# Altium project nPOC-BB_beta_main-board.PrjPcb (part 1 of 4)
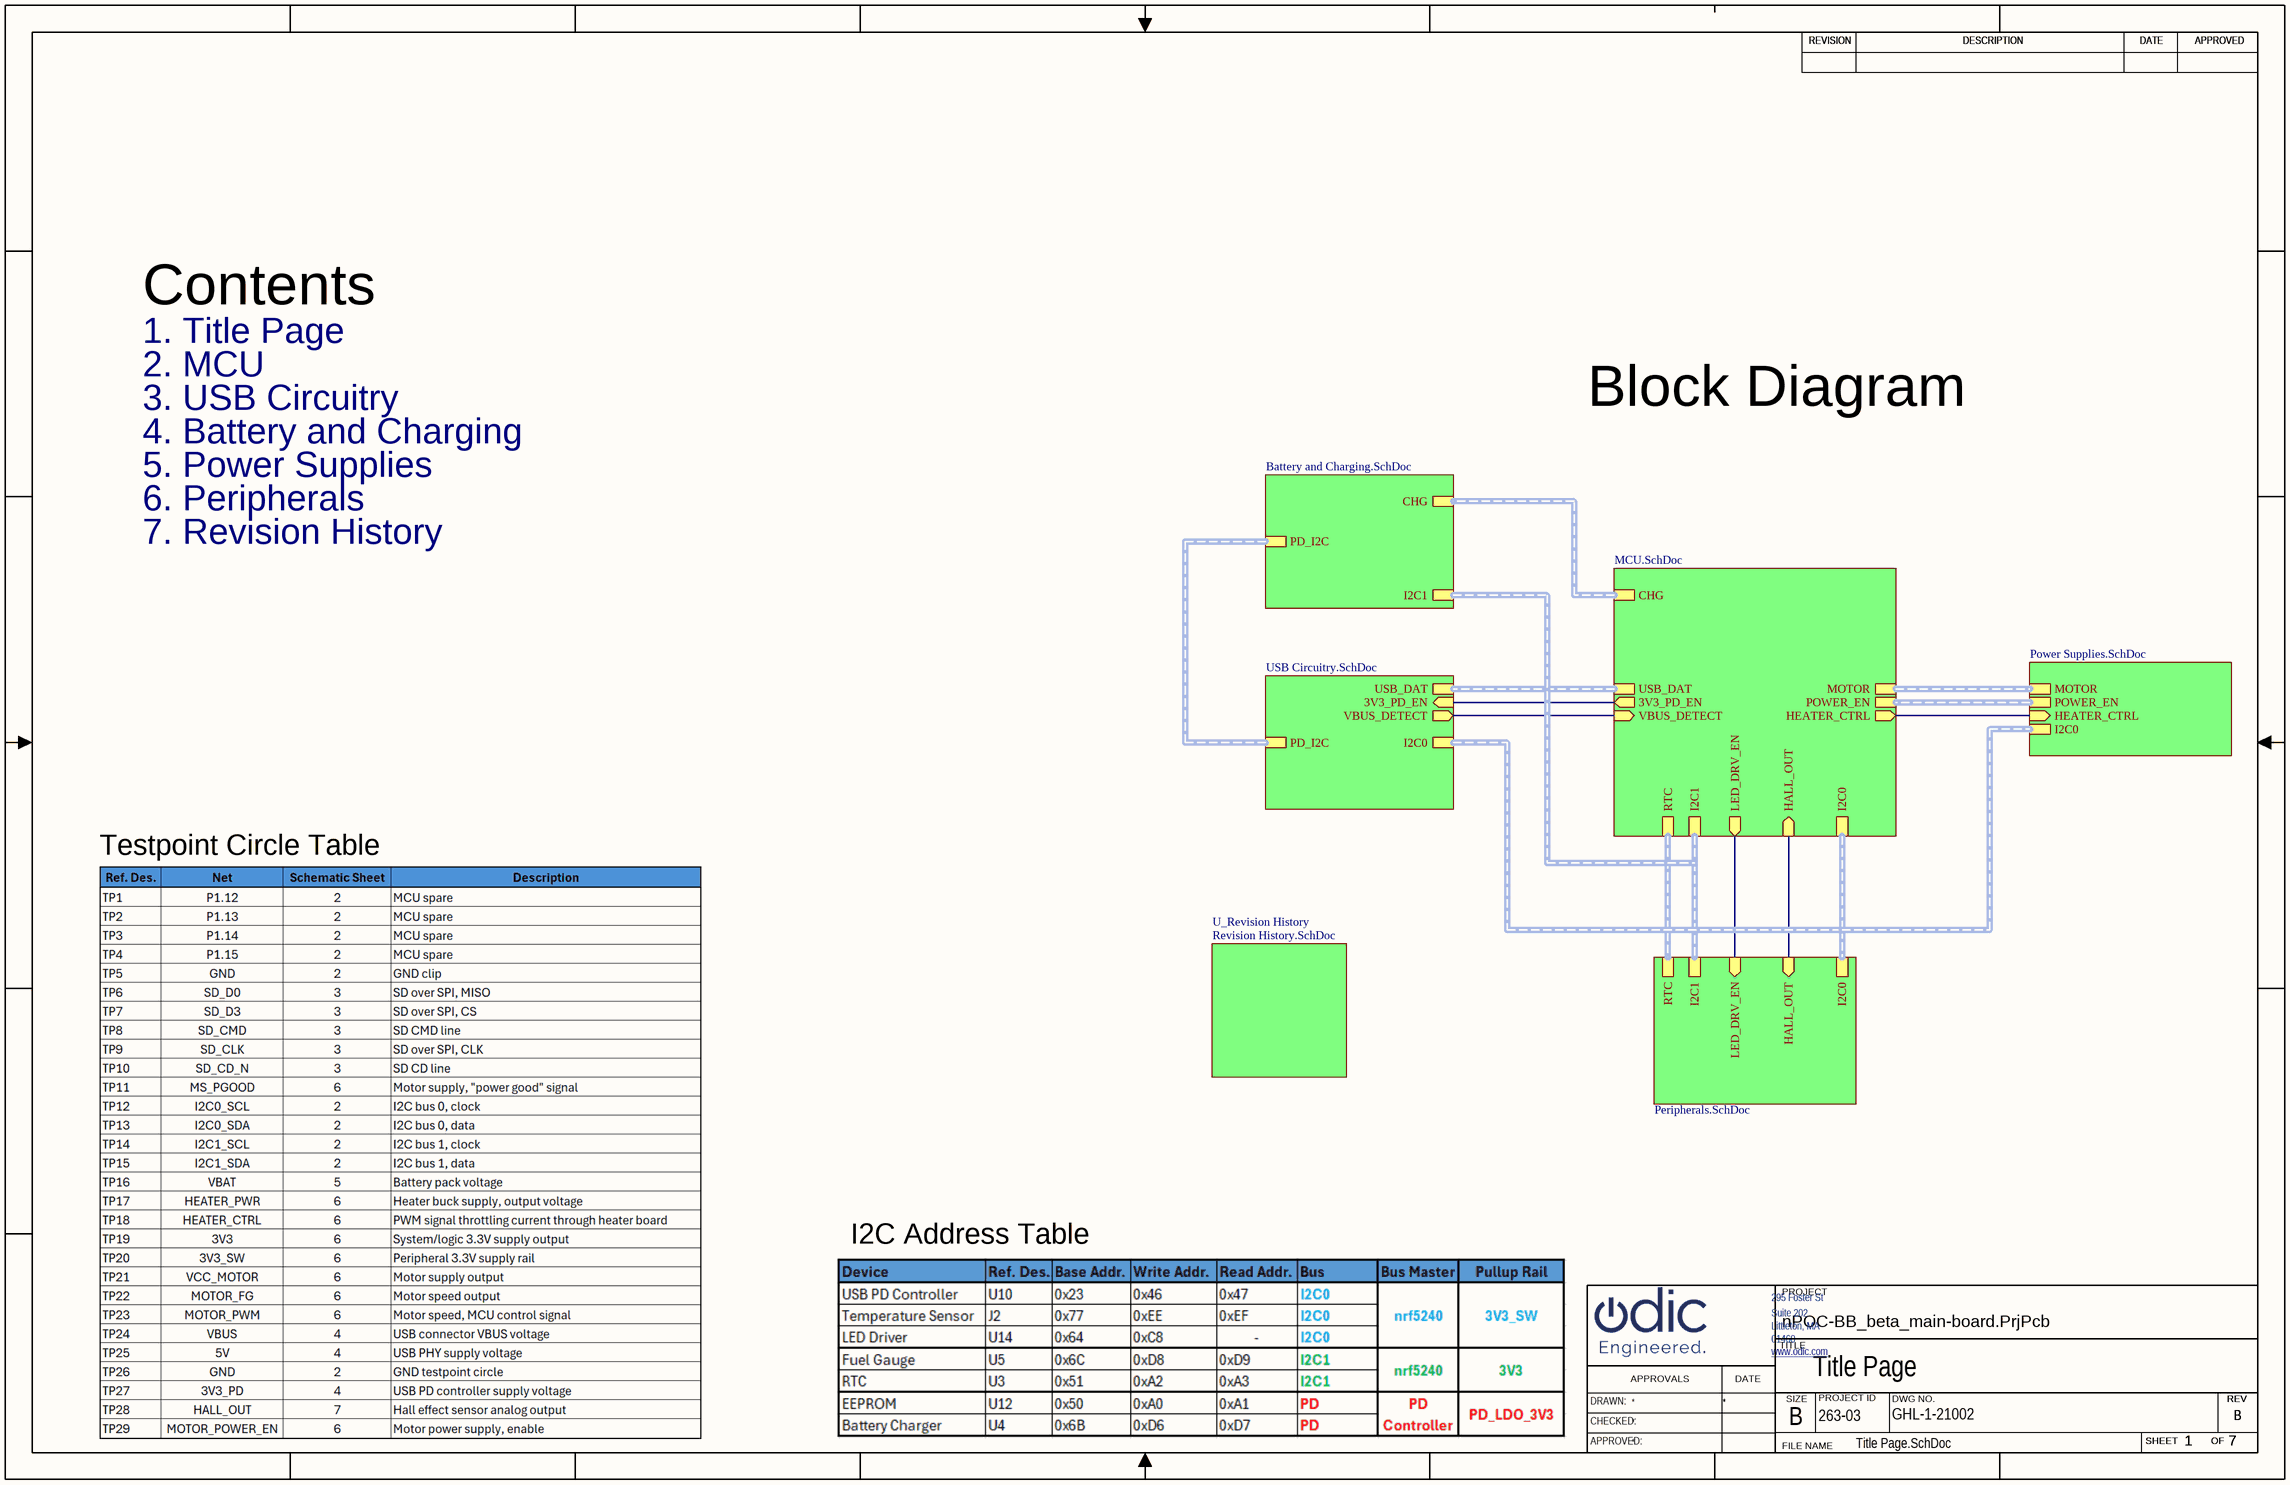
[diagram p0: Title Page.SchDoc]
7 sheets, 240 parts. Net scope: hierarchical (ports join the sheet entries above them; power ports are global).
Board file: nPOC-BB_beta_main-board.PcbDoc
Sheets:
  Title Page.SchDoc
    U_MCU = MCU.SchDoc
    U_USB Circuitry = USB Circuitry.SchDoc
    U_Battery and Charging = Battery and Charging.SchDoc
    U_Power Supplies = Power Supplies.SchDoc
    U_Peripherals = Peripherals.SchDoc
    U_Revision History = Revision History.SchDoc

## Sheet Title Page.SchDoc: Title Page
size 431 x 279 mm; DocumentNumber: GHL-1-21002; Revision: B; SheetNumber: 1; SheetTotal: 7; ProjectID: 263-03

### Sub-sheets
U_Battery and Charging = Battery and Charging.SchDoc: CHG (harness CHARGER), PD_I2C (harness I2C), I2C1 (harness I2C)
U_MCU = MCU.SchDoc: I2C0 (harness I2C), CHG (harness CHARGER), VBUS_DETECT (in), POWER_EN (harness Power Enables), LED_DRV_EN (out), 3V3_PD_EN (out), USB_DAT (harness USB_DAT), HALL_OUT (in), HEATER_CTRL (out), RTC (harness RTC), I2C1 (harness I2C), MOTOR (harness Motor)
U_Peripherals = Peripherals.SchDoc: I2C0 (harness I2C), LED_DRV_EN (in), I2C1 (harness I2C), RTC (harness RTC), HALL_OUT (in)
U_Power Supplies = Power Supplies.SchDoc: POWER_EN (harness Power Enables), I2C0 (harness I2C), HEATER_CTRL (in), MOTOR (harness Motor)
U_Revision History = Revision History.SchDoc: no entries
U_USB Circuitry = USB Circuitry.SchDoc: USB_DAT (harness USB_DAT), VBUS_DETECT (out), I2C0 (harness I2C), PD_I2C (harness I2C), 3V3_PD_EN (in)

### Nets
3V3_PD_EN: sheet U_MCU/3V3_PD_EN, sheet U_USB Circuitry/3V3_PD_EN
HALL_OUT: sheet U_MCU/HALL_OUT, sheet U_Peripherals/HALL_OUT
HEATER_CTRL: sheet U_MCU/HEATER_CTRL, sheet U_Power Supplies/HEATER_CTRL
LED_DRV_EN: sheet U_MCU/LED_DRV_EN, sheet U_Peripherals/LED_DRV_EN
VBUS_DETECT: sheet U_MCU/VBUS_DETECT, sheet U_USB Circuitry/VBUS_DETECT

### Buses and harness runs
harness sheet U_Battery and Charging/CHG = sheet U_MCU/CHG
harness sheet U_Battery and Charging/I2C1 = sheet U_MCU/I2C1 = sheet U_Peripherals/I2C1
harness sheet U_Battery and Charging/PD_I2C = sheet U_USB Circuitry/PD_I2C
harness sheet U_MCU/I2C0 = sheet U_Peripherals/I2C0 = sheet U_Power Supplies/I2C0 = sheet U_USB Circuitry/I2C0
harness sheet U_MCU/MOTOR = sheet U_Power Supplies/MOTOR
harness sheet U_MCU/POWER_EN = sheet U_Power Supplies/POWER_EN
harness sheet U_MCU/RTC = sheet U_Peripherals/RTC
harness sheet U_MCU/USB_DAT = sheet U_USB Circuitry/USB_DAT

### Notes on the sheet
- Contents
- 1. Title Page
- 2. MCU
- 3. USB Circuitry
- Block Diagram
- 4. Battery and Charging
- 5. Power Supplies
- 6. Peripherals
- 7. Revision History
- Testpoint Circle Table
- I2C Address Table
- REVISION
- DESCRIPTION
- DATE
- APPROVED
- 295 Foster St
- PROJECT
- www.odic.com <http://www.odic.com>
- Littleton, MA
- 01460
- Suite 202
- TITLE
- DRAWN:
- CHECKED:
- APPROVALS
- SIZE
- B
- PROJECT ID
- DWG NO.
- SHEET
- OF
- REV
- APPROVED:
- FILE NAME

## Sheet MCU.SchDoc: MCU
size 431 x 279 mm; DrawnBy: DD; DocumentNumber: GHL-1-21002; Revision: B; SheetNumber: 2; SheetTotal: 7; ProjectID: 263-03
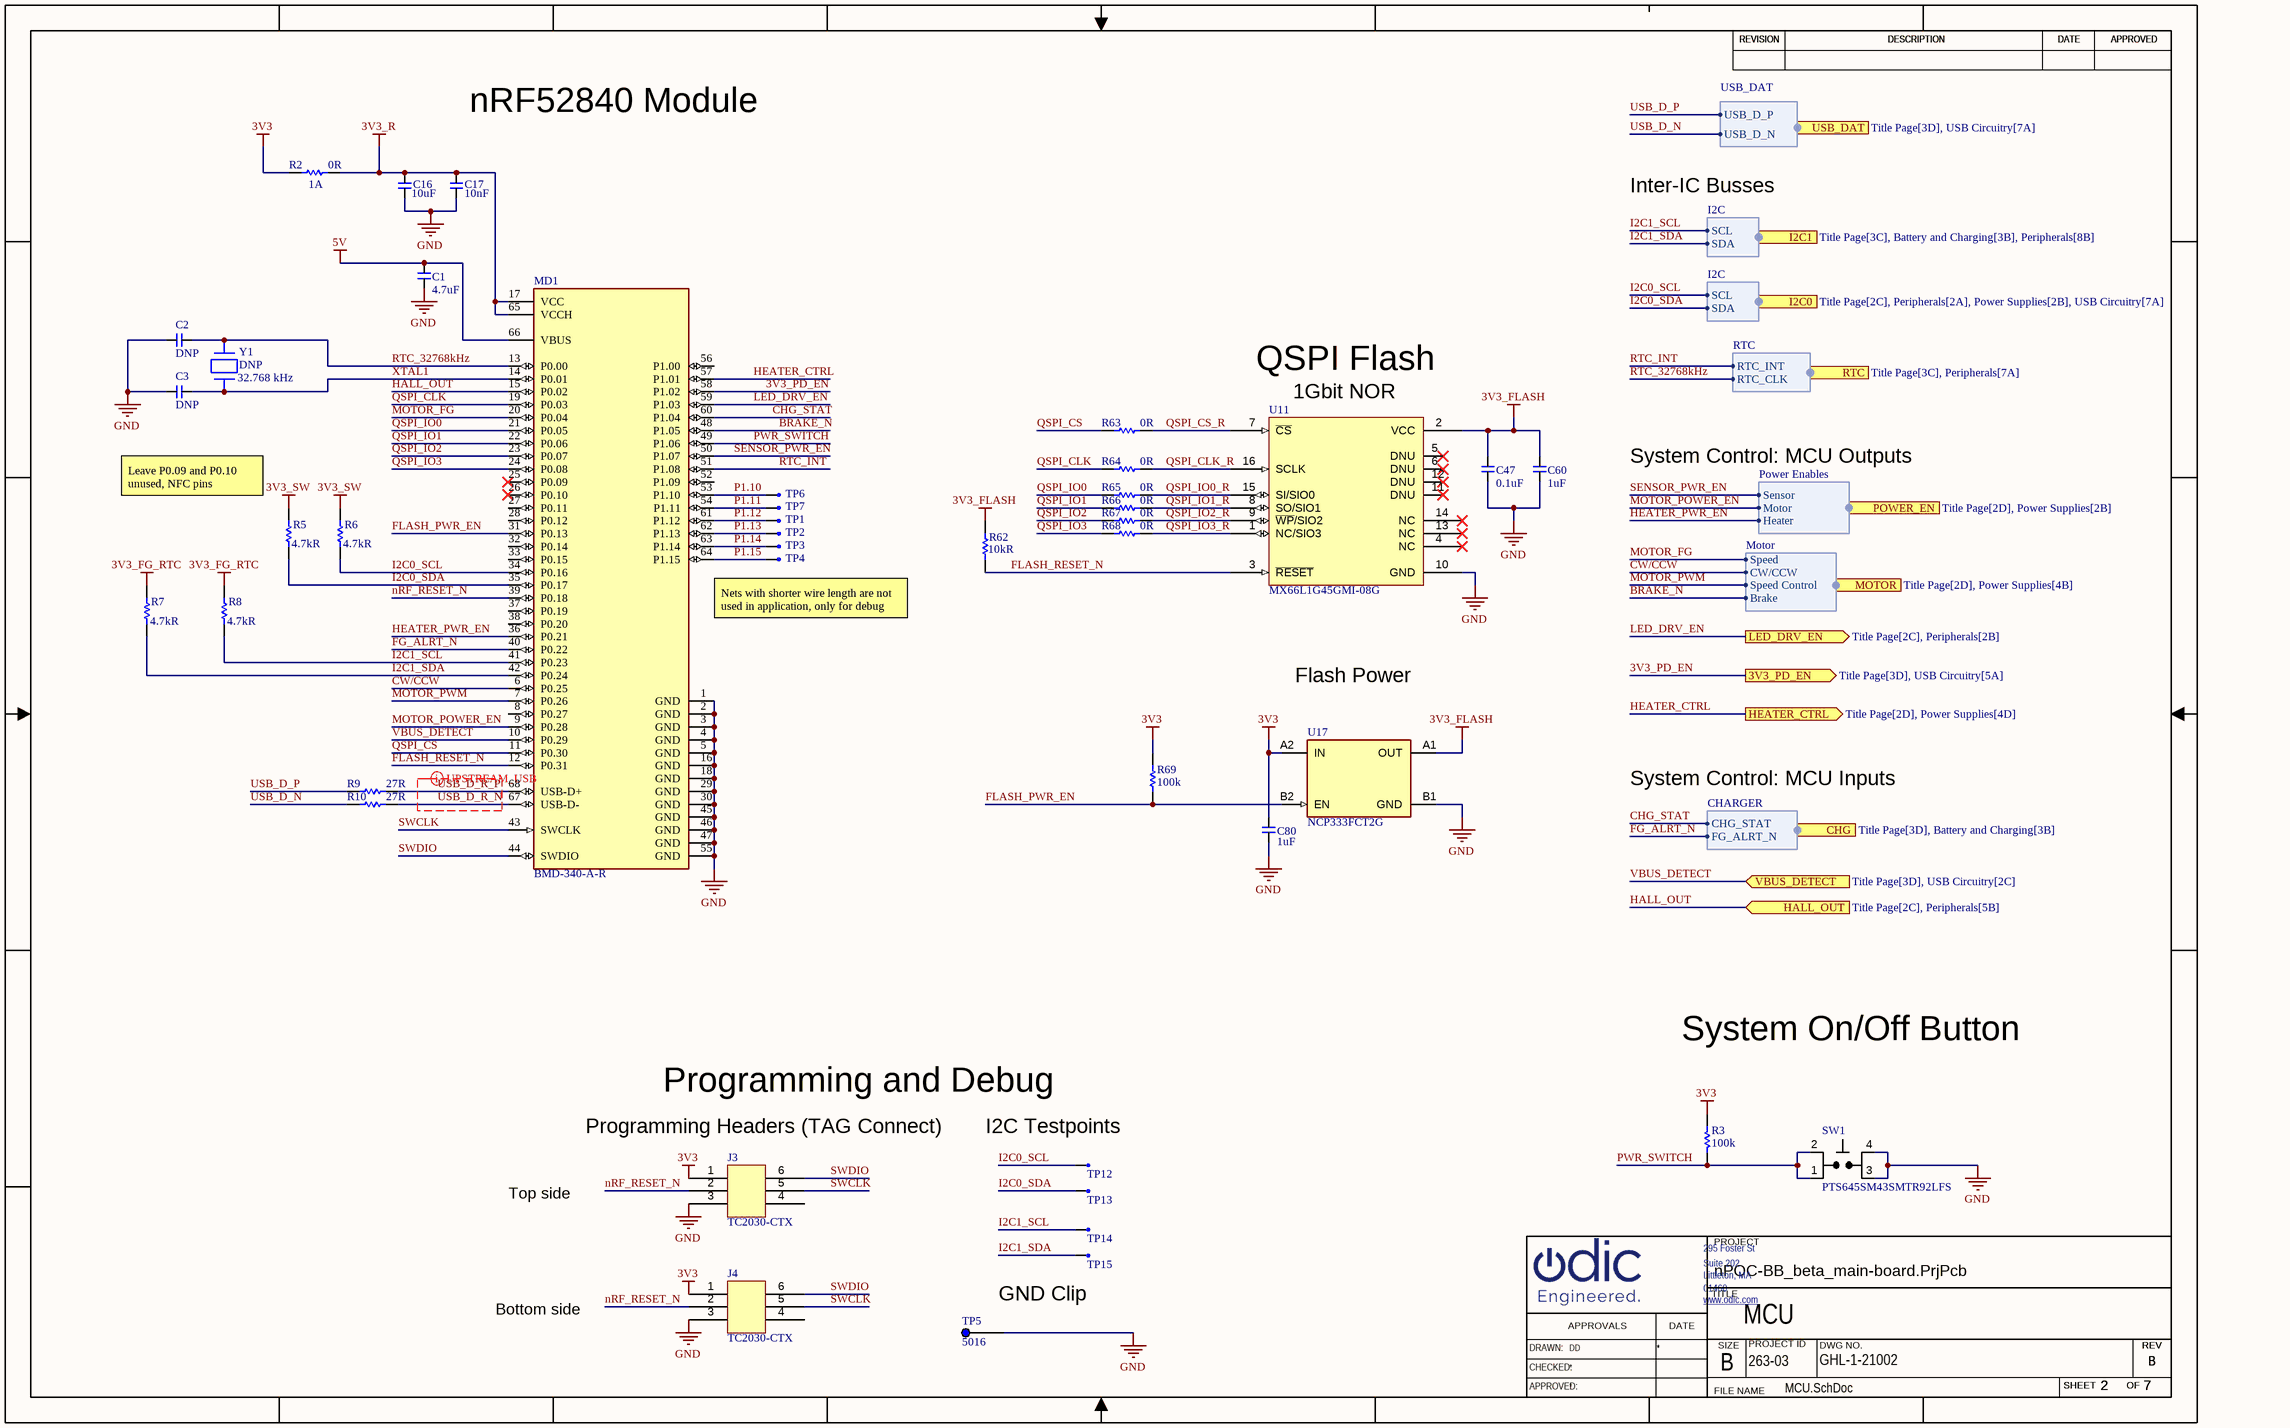
[diagram p1: MCU.SchDoc]

### Parts
C1  4.7uF  [C0603]
C2  DNP  [C0402]
C3  DNP  [C0402]
C16  Capacitance: 10uF  [C0402]  (hidden comment: C0402_10u_6V3_20pct)
C17  Capacitance: 10nF  [C0402]  (hidden comment: C0402_10n_6V3_10pct)
C47  0.1uF  [C0402]
C60  1uF  [C0402]
C80  Capacitance: 1uF  [C0402]  (hidden comment: C0402_1u_6V3_10pct)
J3  TC2030-CTX  [tc2030-ctx]
J4  TC2030-CTX  [tc2030-ctx]
MD1  BMD-340-A-R  [BMD-340-A-R]
R2  Resistance: 0R  Current Rating: 1A  [R0603]  (hidden comment: R0603_0R)
R3  100k  [R0402]
R5  Resistance: 4.7kR  [R0402]  (hidden comment: R0402_4k7_1pct)
R6  Resistance: 4.7kR  [R0402]  (hidden comment: R0402_4k7_1pct)
R7  Resistance: 4.7kR  [R0402]  (hidden comment: R0402_4k7_1pct)
R8  Resistance: 4.7kR  [R0402]  (hidden comment: R0402_4k7_1pct)
R9  27R  [R0402]
R10  27R  [R0402]
R62  Resistance: 10kR  [R0402]  (hidden comment: R0402_10k_1pct)
R63  0R  [R0402]
R64  0R  [R0402]
R65  0R  [R0402]
R66  0R  [R0402]
R67  0R  [R0402]
R68  0R  [R0402]
R69  100k  [R0402]
SW1  PTS645SM43SMTR92LFS  [swt_pb_pts645s]
TP1  TPC30  [tpc30]  (value not drawn)
TP2  TPC30  [tpc30]  (value not drawn)
TP3  TPC30  [tpc30]  (value not drawn)
TP4  TPC30  [tpc30]  (value not drawn)
TP5  5016  [KEYSTONE_5016]
TP6  TPC30  [tpc30]  (value not drawn)
TP7  TPC30  [tpc30]  (value not drawn)
TP12  TPC30  [tpc30]  (value not drawn)
TP13  TPC30  [tpc30]  (value not drawn)
TP14  TPC30  [tpc30]  (value not drawn)
TP15  TPC30  [tpc30]  (value not drawn)
U11  MX66L1G45GMI-08G  [sol16]
U17  NCP333FCT2G  [bga4_p743xp743_p4mm]
Y1  DNP  Operating Frequency: 32.768 kHz  [xtal2_3p2x1p5]

### Ports
3V3_PD_EN (out, see Title Page[3D], USB Circuitry[5A]), CHG (harness CHARGER, see Title Page[3D], Battery and Charging[3B]), HALL_OUT (in, see Title Page[2C], Peripherals[5B]), HEATER_CTRL (out, see Title Page[2D], Power Supplies[4D]), I2C0 (harness I2C, see Title Page[2C], Peripherals[2A], Power Supplies[2B], USB Circuitry[7A]), I2C1 (harness I2C, see Title Page[3C], Battery and Charging[3B], Peripherals[8B]), LED_DRV_EN (out, see Title Page[2C], Peripherals[2B]), MOTOR (harness Motor, see Title Page[2D], Power Supplies[4B]), POWER_EN (harness Power Enables, see Title Page[2D], Power Supplies[2B]), RTC (harness RTC, see Title Page[3C], Peripherals[7A]), USB_DAT (harness USB_DAT, see Title Page[3D], USB Circuitry[7A]), VBUS_DETECT (in, see Title Page[3D], USB Circuitry[2C])

### Harnesses
I2C: SCL, SDA
CHARGER: CHG_STAT, FG_ALRT_N
USB_DAT: USB_D_P, USB_D_N
Power Enables: Sensor, Motor, Heater
RTC: RTC_INT, RTC_CLK
Motor: Speed, CW/CCW, Speed Control, Brake

### Nets
3V3: C80.2 J3.1 J4.1 R2.1 R3.2 R69.1 U17.A2(IN)
3V3_FG_RTC: R7.2 R8.2
3V3_FLASH: C47.2 C60.2 R62.1 U11.2(VCC) U17.A1(OUT)
3V3_R: C16.2 C17.2 MD1.17(VCC) MD1.65(VCCH) R2.2
3V3_SW: R5.2 R6.2
5V: C1.2 MD1.66(VBUS)
GND: C1.1 C2.1 C3.1 C16.1 C17.1 C47.1 C60.1 C80.1 J3.3 J4.3 MD1.1(GND) MD1.2(GND) MD1.3(GND) MD1.4(GND) MD1.5(GND) MD1.16(GND) MD1.18(GND) MD1.29(GND) MD1.30(GND) MD1.45(GND) MD1.46(GND) MD1.47(GND) MD1.55(GND) SW1.3 SW1.4 TP5.1 U11.10(GND) U17.B1(GND)
3V3_PD_EN: MD1.58(P1.02) ; port 3V3_PD_EN
BRAKE_N: MD1.48(P1.05) ; port MOTOR.Brake
CHG_STAT: MD1.60(P1.04) ; port CHG.CHG_STAT
CW/CCW: MD1.6(P0.25) ; port MOTOR.CW/CCW
FG_ALRT_N: MD1.40(P0.22) ; port CHG.FG_ALRT_N
FLASH_PWR_EN: MD1.31(P0.13) R69.2 U17.B2(EN)
FLASH_RESET_N: MD1.12(P0.31) R62.2 U11.3(~{RESET})
HALL_OUT: MD1.15(P0.02) ; port HALL_OUT
HEATER_CTRL: MD1.57(P1.01) ; port HEATER_CTRL
HEATER_PWR_EN: MD1.36(P0.21) ; port POWER_EN.Heater
I2C0_SCL: MD1.34(P0.16) R6.1 TP12.1 ; port I2C0.SCL
I2C0_SDA: MD1.35(P0.17) R5.1 TP13.1 ; port I2C0.SDA
I2C1_SCL: MD1.41(P0.23) R8.1 TP14.1 ; port I2C1.SCL
I2C1_SDA: MD1.42(P0.24) R7.1 TP15.1 ; port I2C1.SDA
LED_DRV_EN: MD1.59(P1.03) ; port LED_DRV_EN
MOTOR_FG: MD1.20(P0.04) ; port MOTOR.Speed
MOTOR_POWER_EN: MD1.9(P0.28) ; port POWER_EN.Motor
MOTOR_PWM: MD1.7(P0.26) ; port MOTOR.Speed Control
nRF_RESET_N: J3.2 J4.2 MD1.39(P0.18)
P1.10: MD1.53(P1.10) TP6.1
P1.11: MD1.54(P1.11) TP7.1
P1.12: MD1.61(P1.12) TP1.1
P1.13: MD1.62(P1.13) TP2.1
P1.14: MD1.63(P1.14) TP3.1
P1.15: MD1.64(P1.15) TP4.1
PWR_SWITCH: MD1.49(P1.06) R3.1 SW1.1 SW1.2
QSPI_CLK: MD1.19(P0.03) R64.1
QSPI_CLK_R: R64.2 U11.16(SCLK)
QSPI_CS: MD1.11(P0.30) R63.1
QSPI_CS_R: R63.2 U11.7(~{CS})
QSPI_IO0: MD1.21(P0.05) R65.1
QSPI_IO0_R: R65.2 U11.15(SI/SIO0)
QSPI_IO1: MD1.22(P0.06) R66.1
QSPI_IO1_R: R66.2 U11.8(SO/SIO1)
QSPI_IO2: MD1.23(P0.07) R67.1
QSPI_IO2_R: R67.2 U11.9(~{WP}/SIO2)
QSPI_IO3: MD1.24(P0.08) R68.1
QSPI_IO3_R: R68.2 U11.1(NC/SIO3)
RTC_32768kHz: C2.2 MD1.13(P0.00) Y1.1 ; port RTC.RTC_CLK
RTC_INT: MD1.51(P1.08) ; port RTC.RTC_INT
SENSOR_PWR_EN: MD1.50(P1.07) ; port POWER_EN.Sensor
SWCLK: J3.5 J4.5 MD1.43(SWCLK)
SWDIO: J3.6 J4.6 MD1.44(SWDIO)
USB_D_N: R10.1 ; port USB_DAT.USB_D_N
USB_D_P: R9.1 ; port USB_DAT.USB_D_P
USB_D_R_N: MD1.67(USB-D-) R10.2
USB_D_R_P: MD1.68(USB-D+) R9.2
VBUS_DETECT: MD1.10(P0.29) ; port VBUS_DETECT
XTAL1: C3.2 MD1.14(P0.01) Y1.2

Not connected (* = marked no-connect by the designer): J3 4; J4 4; MD1 8(P0.27) 25(P0.09)* 26(P0.10)* 27(P0.11) 28(P0.12) 32(P0.14) 33(P0.15) 37(P0.19) 38(P0.20) 52(P1.09) 56(P1.00); U11 4(NC)* 5(DNU)* 6(DNU)* 11(DNU)* 12(DNU)* 13(NC)* 14(NC)*

### Layout directives
differential pair: USB_D_R_N, USB_D_R_P

### Notes on the sheet
- nRF52840 Module
- Inter-IC Busses
- QSPI Flash
- (near U11) 1Gbit NOR
- System Control: MCU Outputs
- (near R5) Leave P0.09 and P0.10 unused, NFC pins
- Nets with shorter wire length are not used in application, only for debug
- Flash Power
- System Control: MCU Inputs
- System On/Off Button
- Programming and Debug
- (near J3) Programming Headers (TAG Connect)
- (near TP12) I2C Testpoints
- Top side
- Bottom side
- GND Clip
- REVISION
- DESCRIPTION
- DATE
- APPROVED
- 295 Foster St
- PROJECT
- www.odic.com <http://www.odic.com>
- Littleton, MA
- 01460
- Suite 202
- TITLE
- DRAWN:
- CHECKED:
- APPROVALS
- SIZE
- B
- PROJECT ID
- DWG NO.
- SHEET
- OF
- REV
- APPROVED:
- FILE NAME

### Library data of the parts
C1 = CMP-00579-3: CAP CER 4.7UF 25V X5R 0603; Dielectric Material: Ceramic; Tolerance: 20%; Install: POP; Case Code (Imperial): 0603; Case Code (Metric): 1608; Value: 4.7uF; Case/Package: 0603; Radiation Hardening: No; Voltage Rating (DC): 25V; Width: 0.031inch; Min Operating Temperature: -55°C; Depth: 0.8mm; Mounting Technology: Surface Mount; Max Operating Temperature: 85°C; RoHS Compliant: Yes; Weight: 7.1E-05oz; Length: 1.6mm; Height: 0.8mm; Package Quantity: 1; Dielectric: X5R; Termination: SMD/SMT; Voltage Rating: 25V; Reach SVHC Compliant: Unknown; Series: C; Thickness: 0.039inch; Packaging: Tape and Reel; Lead Free: Lead Free
C2 C3 = CMP-00017-6: Blank pads for future cap placements; Install: DNP; Odic Footprint: C0402
C16 = CMP-00337-1: Cap Ceramic 10uF 6.3V X5R 20% SMD 0402 85°C Paper T/R; Install: POP; Mount: Surface Mount; Construction: Flat; Case Code (Imperial): 0402; Case/Package: 0402; Series: CL; Package Quantity: 1; Width: 0.02inch; Dielectric: X5R; Radiation Hardening: No; Case Code (Metric): 1005; RoHS Compliant: Yes; Depth: 0.5mm; Height: 0.5mm; Packaging: Tape and Reel; Min Operating Temperature: -55°C; Tolerance: 20%; Voltage Rating: 6.3V; Max Operating Temperature: 85°C; Thickness: 0.028inch; Length: 1mm
C17 = CMP-00314-2: CAP CER 10000PF 25V 10% X7R 0402; Install: POP; Ratings: AEC-Q200; Lead Free: Lead Free; Series: GCM; Tolerance: 10%; Min Operating Temperature: -55°C; Thickness: 0.022inch; Case Code (Imperial): 0402; Width: 0.02inch; Construction: Flat; Length: 1mm; Radiation Hardening: No; Termination: SMD/SMT; Height: 0.5mm; REACH SVHC: No SVHC; Voltage Rating: 25V; Depth: 0.5mm; RoHS Compliant: Yes; Package Quantity: 1; Mount: Surface Mount; Case Code (Metric): 1005; Dielectric: X7R; Packaging: Tape and Reel; Voltage Rating (DC): 25V; Max Operating Temperature: 125°C; Voltage: 25V; Case/Package: 0402
C47 = CMP-00369-1: Cap Ceramic 0.1uF 25V X5R 10% Pad SMD 0402 Multi Layer Ceramic Capacitor (MLCC); Capacitance: 100nF; Install: POP; Packaging: Tape and Reel; Construction: Flat; Max Operating Temperature: 85°C; Case Code (Metric): 1005; Voltage Rating (DC): 25V; Min Operating Temperature: -55°C; Height: 0.5mm; Series: CL; Case/Package: 0402; Voltage: 25V; Package Quantity: 1; Radiation Hardening: No; Depth: 0.5mm; Thickness: 0.022inch; Lead Free: Lead Free; Tolerance: 10%; Length: 1mm; Mount: Surface Mount; Width: 0.02inch; Dielectric: X5R; RoHS Compliant: Yes; Voltage Rating: 25V; Case Code (Imperial): 0402
C60 = CMP-00317-1: CAP CER 1UF 16V X5R 0402; Install: POP; Tolerance: 10%; Thickness: 0.022inch; Radiation Hardening: No; Voltage Rating: 16V; Length: 1mm; Voltage: 16V; Capacitance: 1uF; Dielectric: X5R; Packaging: Tape and Reel; Contact Plating: Tin; Min Operating Temperature: -55°C; Series: CL; Depth: 0.5mm; Case Code (Imperial): 0402; Case Code (Metric): 1005; Package Quantity: 1; RoHS Compliant: Yes; Height: 0.5mm; Mount: Surface Mount; Max Operating Temperature: 85°C; Case/Package: 0402; Width: 0.02inch; Construction: Flat
C80 = CMP-00342-1: Cap Ceramic 1uF 6.3V X5R 10% SMD 0402 85C Paper T/R; Install: POP; Max Operating Temperature: 85°C; RoHS Compliant: Yes; Number of Pins: 2; Packaging: Tape and Reel; Thickness: 0.022inch; Lead Free: Lead Free; Package Quantity: 10000; Tolerance: 10%; Height: 0.5mm; Depth: 0.5mm; Construction: Flat; Radiation Hardening: No; REACH SVHC: No SVHC; Dielectric: X5R; Resistor Type: Ceramic; Min Operating Temperature: -55°C; Series: M; Width: 0.5mm; Case/Package: 0402; Voltage Rating: 6.3V; Case Code (Imperial): 0402; Length: 1mm; Voltage Rating (DC): 6.3V; Halogen Free: Halogen Free; Termination: SMD/SMT; Mount: Surface Mount; Case Code (Metric): 1005
J3 J4 = CMP-00997-3: Cbl Plug-of-nails to Cortex Swd; Install: DNP; Series: Plug-Of-Nails™
MD1 = CMP-002-000005-3: BMD-340 Series 3.6 V 2.5 GHz -96 dBm Stand-Alone Bluetooth 5 Low Energy Module; Data Rate: 2Mbps; Memory Size: 256KB; MP: BMD-330-A-R; Sensitivity: -103dBm; Current - Transmitting: 26.7mA; Interface: I2C,SPI,UART; Frequency: 2.5GHz; Current - Receiving: 11.7mA; Install: POP; Series: BMD-34; Package: None; Price: None; Source: BMD-330-A-R.SchLib; RoHS Compliant: Yes; Min Operating Temperature: -40°C; Max Operating Temperature: 85°C; Design Item ID: BMD-330-A-R; Case/Package: Module; Packaging: Tape and Reel; Mounting Technology: Surface Mount
R2 = CMP-00334-1: Res Thkflm 0603 0 Ohm Jumper 1/10W 100Ppm/ C Smd Rohs Compliant: Yes; Working Voltage: 75V; Max Power Dissipation: 100mW; Install: POP; Case/Package: 0603; Case Code (Metric): 1608; RoHS Compliant: Yes; Contact Plating: Tin,Matte; Length: 1.55mm; Series: RMCF; Radiation Hardening: No; Features: Automotive AEC-Q200; Military Standard: Not; Max Operating Temperature: 155°C; Number of Terminations: 2; Packaging: Tape and Reel; Case Code (Imperial): 0603; Mount: Surface Mount; Min Operating Temperature: -55°C; Power Rating: 100mW; Width: 0.031inch; Depth: 0.8mm; Resistor Type: Thick Film; Height: 0.022inch; Construction: Rectangular; Lead Free: Lead Free
R3 R69 = CMP-00351-1: Res General Purpose Thick Film 0402 100K Ohm 1% 1/16W ±100ppm/°C Molded SMD Paper T/R; Working Voltage: 50V; Resistance: 100kR; Install: POP; Power Rating: 63mW; Series: RC; Military Standard: Not; Case Code (Metric): 1005; Features: Moisture Resistant; Termination: SMD/SMT; Number of Terminations: 2; Temperature Coefficient: 100ppm/°C; Height: 0.016inch; Tolerance: 1%; Case/Package: 0402; Depth: 0.5mm; RoHS Compliant: Yes; Resistance Tolerance: 1%; Lead Free: Lead Free; Max Operating Temperature: 155°C; Min Operating Temperature: -55°C; Width: 0.02inch; Packaging: Tape and Reel; Technology: THICK FILM; Case Code (Imperial): 0402; Package Quantity: 1; REACH SVHC: No SVHC; Resistor Type: Thick Film; Max Power Dissipation: 63mW; Voltage Rating: 50V; Length: 0.039inch; Construction: Rectangular
R5-R8 = CMP-00336-2: RES 4.7K OHM 1% 1/16W 0402; Install: POP; Temperature Coefficient: 100ppm/°C; Voltage Rating: 50V; Max Power Dissipation: 63mW; Power Rating: 62.5mW; Features: Moisture Resistant; Length: 1mm; REACH SVHC: No SVHC; RoHS Compliant: Yes; Military Standard: Not; Size Code: 0402; Series: RC; Width: 0.5mm; Lead Free: Lead Free; Max Operating Temperature: 155°C; Height: 0.32mm; Voltage Rating (DC): 50V; Construction: Rectangular; Packaging: Tape and Reel; Tolerance: 1%; Case Code (Metric): 1005; Case Code (Imperial): 0402; Number of Pins: 2; Resistor Type: Thick Film; Number of Terminations: 2; Termination: SMD/SMT; Min Operating Temperature: -55°C; Case/Package: 0402; Height - Seated (Max): 0.016inch; Resistance Tolerance: 1%; Depth: 0.5mm
R9 R10 = CMP-009-00036-1: SMD Chip Resistor, 27 Ohm, ± 1%, 100 mW, 0402 [1005 Metric], Thick Film, Precision; Install: POP; Temperature Coefficient: 100ppm/°C; Power Rating: 100mW; Voltage Rating (DC): 50V; Min Operating Temperature: -55°C; Number of Terminations: 2; Max Operating Temperature: 155°C; Tolerance: 1%; Mounting Technology: Surface Mount; Lead Free: Lead Free; Width: 0.5mm; Package Quantity: 1; Resistor Type: Thick Film; Weight: 2.8E-05oz; Length: 1mm; Technology: THICK FILM; Case Code (Metric): 1005; Series: ERJ; Resistance Tolerance: 1%; Pins: 2; Reach SVHC Compliant: No; Case/Package: 0402; Packaging: Tape and Reel; Height: 0.35mm; Max Power Dissipation: 100mW; Case Code (Imperial): 0402; Value: 27R; Contact Plating: Tin; Features: Automotive AEC-Q200; Voltage Rating: 50V; Depth: 0.5mm; Termination: SMD/SMT; RoHS Compliant: Yes
R62 = CMP-00352-1: Res Thick Film 0402 10K Ohm 1% 1/16W ±100ppm/°C Molded SMD SMD T/R; Max Power Dissipation: 63mW; Install: POP; RoHS Compliant: Yes; Number of Terminations: 2; Case/Package: 0402; Case Code (Metric): 1005; Length: 0.039inch; Military Standard: Not; Size Code: 0402; Series: RC; Height: 0.016inch; Contact Plating: Tin; Features: Moisture Resistant; Width: 0.02inch; Mount: Surface Mount; Temperature Coefficient: 100ppm/°C; Package Quantity: 1; Resistor Type: Thick Film; Min Operating Temperature: -55°C; Max Operating Temperature: 155°C; Power Rating: 63mW; Tolerance: 1%; Depth: 0.5mm; Case Code (Imperial): 0402; Construction: Rectangular; Packaging: Tape and Reel; Radiation Hardening: No
R63-R68 = CMP-00319-1: RES 0 OHM JUMPER 1/16W 0402; Max Power Dissipation: 63mW; Install: POP; Working Voltage: 50V; Current Rating: 1A; Case/Package: 0402; Max Operating Temperature: 155°C; Contact Plating: Tin,Matte; Height: 0.016inch; RoHS Compliant: Yes; Lead Free: Lead Free; Length: 0.039inch; Case Code (Imperial): 0402; Resistor Type: Thick Film; Military Standard: Not; Width: 0.02inch; Construction: Rectangular; Features: Automotive AEC-Q200; Depth: 0.5mm; Case Code (Metric): 1005; Technology: THICK FILM; Number of Terminations: 2; Power Rating: 63mW; Radiation Hardening: No; Min Operating Temperature: -55°C; Series: RMCF; Packaging: Tape and Reel; Mount: Surface Mount; Resistance: 0R
SW1 = CMP-011-00000-2: Switch Tactile N.O. SPST Round Button Gull Wing 0.05A 12VDC 100000Cycles 1.57N SMD T/R; Actuator Type: Standard; Operating Force: 160gf; Number of Positions: 2; Illumination Type: Non-Illuminated,Illuminated; Actuator Material: Nylon,Polyamide,PA66; Max Current Rating: 50mA; Actuator Length: 0.85mm; Switch Function: Off-Mom; Install: POP; Max Voltage Rating (DC): 12V; Contact Resistance: 100mR; Contact Material: Silver; Size: 6mm; Min Operating Temperature: -20°C; RoHS Compliant: Yes; Depth: 9mm; Contact Plating: Silver; Lead Free: Lead Free; Case/Package: SMD/SMT; Length: 6mm; Termination: Gull Wing; Max Operating Temperature: 60°C; Throw Configuration: SPST; Orientation: Straight; Mounting Technology: Surface Mount; Current Rating: 50mA; Contact Current Rating: 50mA; Mechanical Life: 100000Cycles; Packaging: Tape and Reel; Package Quantity: 1; Voltage Rating (DC): 12V; Color: Black; Reach SVHC Compliant: No; Series: PTS645
TP1-TP4 TP6 TP7 TP12-TP15 = CMP-00021-4: Test Point Circle 30; Install: DNP
TP5 = CMP-00809-3: Test point clip, SMT Phos Bronze/Silver 1000pc Tape & Reel; Install: POP; Number of Ports: 1; Length: 3.81mm; Insulation Material: Polycarbonate; Series: -; Depth: 2.48mm; Material: Bronze,Silver; Contact Material: Bronze; Packaging: Tape and Reel; Color: White; Number of Contacts: 1; Orientation: Straight; Package Quantity: 1; RoHS Compliant: Yes; Reach SVHC Compliant: No; Termination: Solder; Height: 0.09inch; Mounting Technology: Surface Mount; Contact Plating: Silver; Lead Free: Lead Free
U11 = CMP-00954-3: MX66L1G45G Series 1 Gb (1 G x 1) 2.7 - 3.6 V SMT Serial Flash Memory - SOP-16; RoHS Compliant: Yes
U17 = CMP-00215-5: IC LOAD SWITCH W/DIS 1.5A 4WLCSP; Interface: On/Off; On-State Resistance: 400mR; Install: POP; Output Configuration: High Side; Max Power Dissipation: 400mW; Operating Supply Voltage: 5.5V; Turn-On Delay Time: 195us; Number of Outputs: 1; Max Operating Temperature: 85°C; Series: -; Max Output Current: 1.5A; Number of Pins: 4; Halogen Free: Halogen Free; RoHS Compliant: Yes; Output Current: 1.5A; Mount: Surface Mount; Min Operating Temperature: -40°C; Packaging: Tape and Reel; Lead Free: Lead Free; Package Quantity: 3000; Power Dissipation: 400mW; Max Supply Current: 1.5A
Y1 = CMP-00624-3: RT3215 Series 0.032768 ±20 ppm 9pF -40°C TO +85°C SMT Tuning Fork Crystal; Value: 9E-12F; Frequency Tolerance: 20ppm; RoHS Compliant: Yes; Min Operating Temperature: -40°C; Max Operating Temperature: 85°C; Lead Free: Lead Free; Load Capacitance: 9pF; Install: DNP

## Sheet USB Circuitry.SchDoc: USB Circuitry
size 431 x 279 mm; DrawnBy: DD; DocumentNumber: GHL-1-21002; Revision: B; SheetNumber: 3; SheetTotal: 7; ProjectID: 263-03
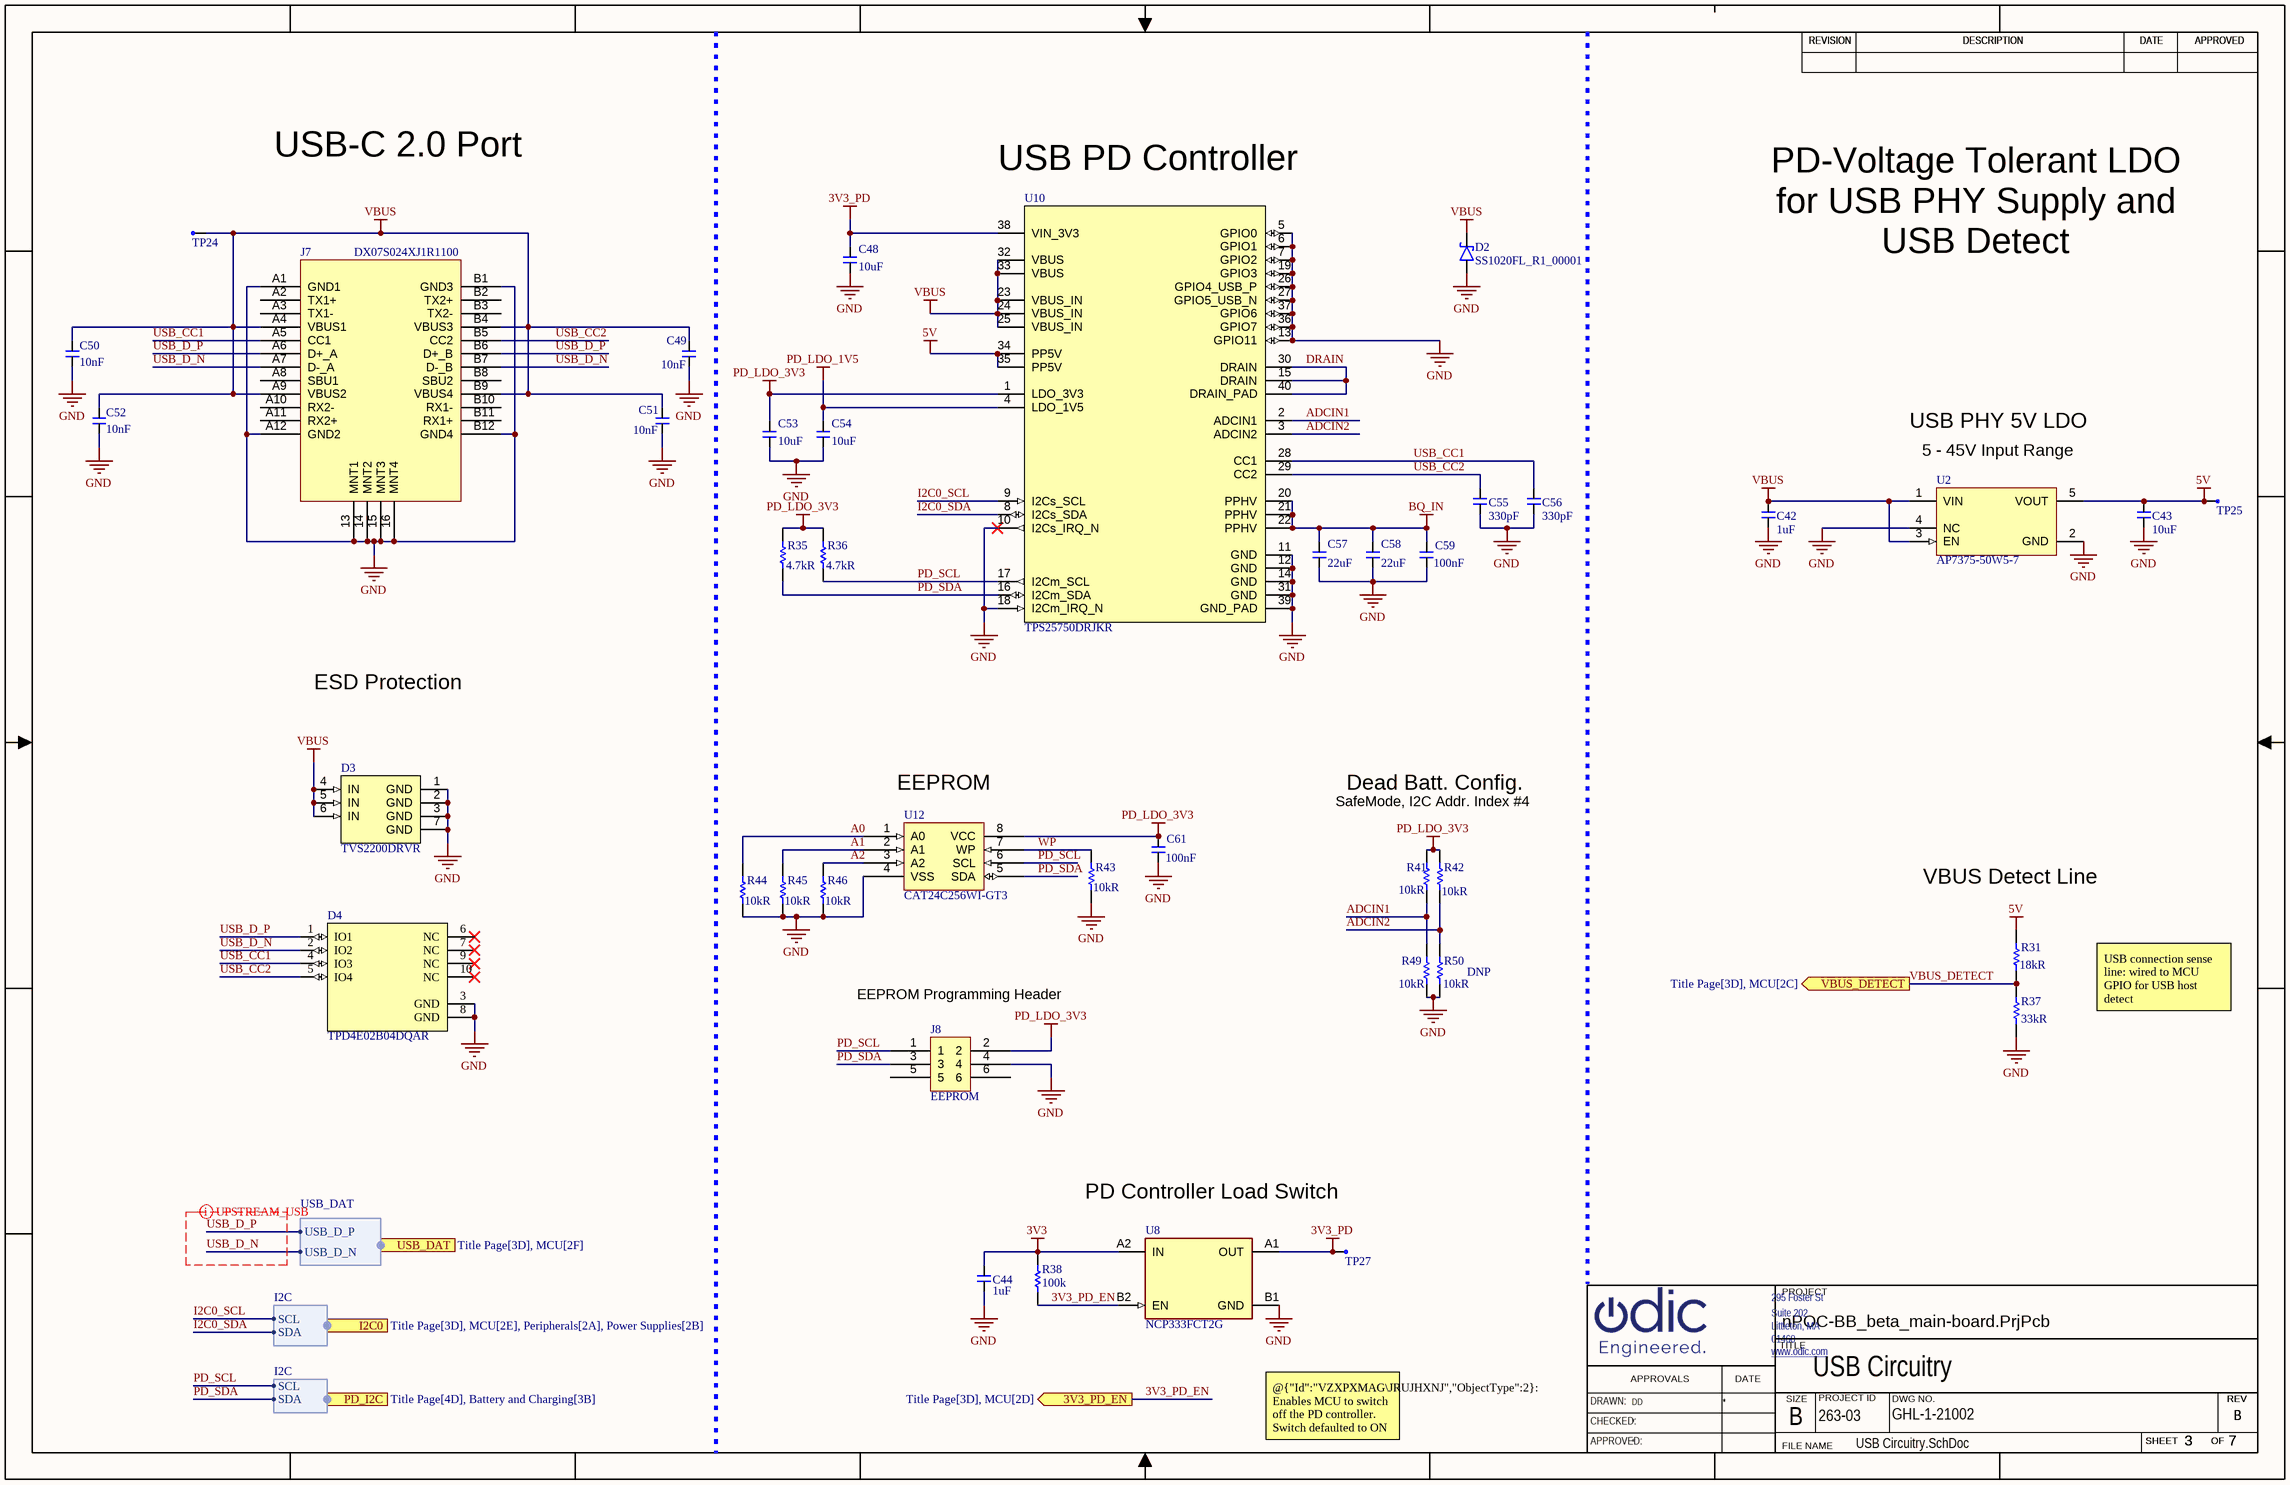
[diagram p2: USB Circuitry.SchDoc]

### Parts
C42  1uF  [C0603]
C43  10uF  [C0402]
C44  Capacitance: 1uF  [C0402]  (hidden comment: C0402_1u_6V3_10pct)
C48  Capacitance: 10uF  [C0402]  (hidden comment: C0402_10u_10V_20pct)
C49  value 10nF  [C0402]  (hidden comment: C0402_10n_35V_10pct)
C50  value 10nF  [C0402]  (hidden comment: C0402_10n_35V_10pct)
C51  value 10nF  [C0402]  (hidden comment: C0402_10n_35V_10pct)
C52  value 10nF  [C0402]  (hidden comment: C0402_10n_35V_10pct)
C53  Capacitance: 10uF  [C0402]  (hidden comment: C0402_10u_10V_20pct)
C54  Capacitance: 10uF  [C0402]  (hidden comment: C0402_10u_10V_20pct)
C55  value 330pF  [C0402]  (hidden comment: C0402_330p_50V_10pct)
C56  value 330pF  [C0402]  (hidden comment: C0402_330p_50V_10pct)
C57  Capacitance: 22uF  [c0805]  (hidden comment: C0805_22u_25V_20pct)
C58  Capacitance: 22uF  [c0805]  (hidden comment: C0805_22u_25V_20pct)
C59  Capacitance: 100nF  [C0402]  (hidden comment: C0402_0u1_25V_10pct)
C61  Capacitance: 100nF  [C0402]  (hidden comment: C0402_0u1_25V_10pct)
D2  SS1020FL_R1_00001  [sod-123fl_AK]
D3  TVS2200DRVR  [dfn7_2x2_p65mm]
D4  TPD4E02B04DQAR  [dfn10_1p1x2p6_p5mm]
J7  DX07S024XJ1R1100  [USB_JAE_DX07S024XJ1R1100]
J8  EEPROM  [tc2030-mcp-nl]
R31  value 18kR  [R0402]  (hidden comment: R0402_18k_1pct)
R35  Resistance: 4.7kR  [R0402]  (hidden comment: R0402_4k7_1pct)
R36  Resistance: 4.7kR  [R0402]  (hidden comment: R0402_4k7_1pct)
R37  Resistance: 33kR  [R0402]  (hidden comment: R0402_33k_1pct)
R38  100k  [R0402]
R41  Resistance: 10kR  [R0402]  (hidden comment: R0402_10k_1pct)
R42  Resistance: 10kR  [R0402]  (hidden comment: R0402_10k_1pct)
R43  Resistance: 10kR  [R0402]  (hidden comment: R0402_10k_1pct)
R44  Resistance: 10kR  [R0402]  (hidden comment: R0402_10k_1pct)
R45  Resistance: 10kR  [R0402]  (hidden comment: R0402_10k_1pct)
R46  Resistance: 10kR  [R0402]  (hidden comment: R0402_10k_1pct)
R49  Resistance: 10kR  [R0402]  (hidden comment: R0402_10k_1pct)
R50  Resistance: 10kR  Install: DNP  [R0402]  (hidden comment: R0402_10k_1pct)
TP24  TPC30  [tpc30]  (value not drawn)
TP25  TPC30  [tpc30]  (value not drawn)
TP27  TPC30  [tpc30]  (value not drawn)
U2  AP7375-50W5-7  [SOT25]
U8  NCP333FCT2G  [bga4_p743xp743_p4mm]
U10  TPS25750DRJKR  [qfn40_6x4_p4mm-RJK0038B]
U12  CAT24C256WI-GT3  [SO8]

### Ports
3V3_PD_EN (out, see Title Page[3D], MCU[2D]), I2C0 (harness I2C, see Title Page[3D], MCU[2E], Peripherals[2A], Power Supplies[2B]), PD_I2C (harness I2C, see Title Page[4D], Battery and Charging[3B]), USB_DAT (harness USB_DAT, see Title Page[3D], MCU[2F]), VBUS_DETECT (out, see Title Page[3D], MCU[2C])

### Harnesses
USB_DAT: USB_D_P, USB_D_N
I2C: SCL, SDA

### Nets
3V3: C44.2 R38.2 U8.A2(IN)
3V3_PD: C48.2 TP27.1 U8.A1(OUT) U10.38(VIN_3V3)
5V: C43.2 R31.2 TP25.1 U2.5(VOUT) U10.34(PP5V) U10.35(PP5V)
BQ_IN: C57.2 C58.2 C59.2 U10.20(PPHV) U10.21(PPHV) U10.22(PPHV)
GND: C42.1 C43.1 C44.1 C48.1 C49.1 C50.1 C51.1 C52.1 C53.1 C54.1 C55.1 C56.1 C57.1 C58.1 C59.1 C61.1 D2.A D3.1(GND) D3.2(GND) D3.3(GND) D3.7(GND) D4.3(GND) D4.8(GND) J7.13(MNT1) J7.14(MNT2) J7.15(MNT3) J7.16(MNT4) J7.A1(GND1) J7.A12(GND2) J7.B1(GND3) J7.B12(GND4) J8.4 R37.1 R43.1 R44.1 R45.1 R46.1 R49.1 R50.1 U2.2(GND) U2.4(NC) U8.B1(GND) U10.5(GPIO0) U10.6(GPIO1) U10.7(GPIO2) U10.10(I2Cs_IRQ_N) U10.11(GND) U10.12(GND) U10.13(GPIO11) U10.14(GND) U10.18(I2Cm_IRQ_N) U10.19(GPIO3) U10.26(GPIO4_USB_P) U10.27(GPIO5_USB_N) U10.31(GND) U10.36(GPIO7) U10.37(GPIO6) U10.39(GND_PAD) U12.4(VSS)
PD_LDO_1V5: C54.2 U10.4(LDO_1V5)
PD_LDO_3V3: C53.2 C61.2 J8.2 R35.2 R36.2 R41.2 R42.2 U10.1(LDO_3V3) U12.8(VCC)
VBUS: C42.2 C49.2 C50.2 C51.2 C52.2 D2.K D3.4(IN) D3.5(IN) D3.6(IN) J7.A4(VBUS1) J7.A9(VBUS2) J7.B4(VBUS3) J7.B9(VBUS4) TP24.1 U2.1(VIN) U2.3(EN) U10.23(VBUS_IN) U10.24(VBUS_IN) U10.25(VBUS_IN) U10.32(VBUS) U10.33(VBUS)
3V3_PD_EN: R38.1 U8.B2(EN) ; port 3V3_PD_EN
A0: R44.2 U12.1(A0)
A1: R45.2 U12.2(A1)
A2: R46.2 U12.3(A2)
ADCIN1: R41.1 R49.2 U10.2(ADCIN1)
ADCIN2: R42.1 R50.2 U10.3(ADCIN2)
DRAIN: U10.15(DRAIN) U10.30(DRAIN) U10.40(DRAIN_PAD)
I2C0_SCL: U10.9(I2Cs_SCL) ; port I2C0.SCL
I2C0_SDA: U10.8(I2Cs_SDA) ; port I2C0.SDA
PD_SCL: J8.1 R36.1 U10.17(I2Cm_SCL) U12.6(SCL) ; port PD_I2C.SCL
PD_SDA: J8.3 R35.1 U10.16(I2Cm_SDA) U12.5(SDA) ; port PD_I2C.SDA
USB_CC1: C56.2 D4.4(IO3) J7.A5(CC1) U10.28(CC1)
USB_CC2: C55.2 D4.5(IO4) J7.B5(CC2) U10.29(CC2)
USB_D_N: D4.2(IO2) J7.A7(D-_A) J7.B7(D-_B) ; port USB_DAT.USB_D_N
USB_D_P: D4.1(IO1) J7.A6(D+_A) J7.B6(D+_B) ; port USB_DAT.USB_D_P
VBUS_DETECT: R31.1 R37.2 ; port VBUS_DETECT
WP: R43.2 U12.7(WP)

Not connected (* = marked no-connect by the designer): D4 6(NC)* 7(NC)* 9(NC)* 10(NC)*; J7 A2(TX1+) A3(TX1-) A8(SBU1) A10(RX2-) A11(RX2+) B2(TX2+) B3(TX2-) B8(SBU2) B10(RX1-) B11(RX1+); J8 5 6

### Layout directives
differential pair: USB_D_N, USB_D_P

### Notes on the sheet
- USB-C 2.0 Port
- USB PD Controller
- PD-Voltage Tolerant LDO for USB PHY Supply and USB Detect
- USB PHY 5V LDO
- (near U2) 5 - 45V Input Range
- ESD Protection
- (near U12) EEPROM
- SafeMode, I2C Addr. Index #4
- Dead Batt. Config.
- VBUS Detect Line
- (near J8) EEPROM Programming Header
- USB connection sense line: wired to MCU GPIO for USB host detect
- PD Controller Load Switch
- @{"Id":"VZXPXMAG\JRUJHXNJ","ObjectType":2}: Enables MCU to switch off the PD controller. Switch defaulted to ON
- REVISION
- DESCRIPTION
- DATE
- APPROVED
- 295 Foster St
- PROJECT
- www.odic.com <http://www.odic.com>
- Littleton, MA
- 01460
- Suite 202
- TITLE
- DRAWN:
- CHECKED:
- APPROVALS
- SIZE
- B
- PROJECT ID
- DWG NO.
- SHEET
- OF
- REV
- APPROVED:
- FILE NAME

### Library data of the parts
C42 = CMP-001-00011-1: Multilayer Ceramic Capacitors MLCC - SMD/SMT 1uF 50V 0603 RoHS; Tolerance: 10%; Install: POP; Dielectric: X5R; Max Operating Temperature: 85°C; Packaging: Tape and Reel; Termination: SMD/SMT; Width: 0.031inch; Voltage Rating (DC): 50V; Length: 0.063inch; Halogen Free: Halogen Free; Case/Package: 0603; Package Quantity: 4000; Lead Free: Lead Free; Voltage Rating: 50V; Resistor Type: Ceramic; Value: 1uF; Thickness: 0.035inch; Weight: 7.1E-05oz; Min Operating Temperature: -55°C; Case Code (Metric): 1608; Case Code (Imperial): 0603; Mounting Technology: Surface Mount; RoHS Compliant: Yes; Series: CC
C43 C48 C53 C54 = CMP-00507-2: Ceramic capacitor SMD; 0402; 10uF; 10V; X5R; 20%; Install: POP; Dielectric: X5R; Tolerance: 20%; Voltage Rating: 10V; Case Code (Imperial): 0402
  C43: Capacitance: 10uF
C44 = CMP-00342-1: as C80 on sheet MCU; Max Operating Temperature: 85°C; RoHS Compliant: Yes; Number of Pins: 2; Packaging: Tape and Reel; Thickness: 0.022inch; Lead Free: Lead Free; Package Quantity: 10000; Tolerance: 10%; Height: 0.5mm; Depth: 0.5mm; Construction: Flat; Radiation Hardening: No; REACH SVHC: No SVHC; Dielectric: X5R; Resistor Type: Ceramic; Min Operating Temperature: -55°C; Series: M; Width: 0.5mm; Case/Package: 0402; Voltage Rating: 6.3V; Case Code (Imperial): 0402; Length: 1mm; Voltage Rating (DC): 6.3V; Halogen Free: Halogen Free; Termination: SMD/SMT; Mount: Surface Mount; Case Code (Metric): 1005
C49-C52 = CMP-00724-2: Multilayer Ceramic Capacitor, 0.01 uF, 35 V, ± 10%, X7R, 0402 [1005 Metric]; Voltage Rating (DC): 35V; Install: POP; Packaging: Tape and Reel; Voltage Rating: 35V; Height: 0.5mm; Package Quantity: 1; Max Operating Temperature: 125°C; Length: 1mm; Width: 0.02inch; RoHS Compliant: Yes; Case/Package: 0402; Weight: 2.3E-05oz; Thickness: 0.022inch; Reach SVHC Compliant: No; Tolerance: 10%; Min Operating Temperature: -55°C; Mounting Technology: Surface Mount; Termination: SMD/SMT; Case Code (Metric): 1005; Dielectric: X7R; Series: CGA; Case Code (Imperial): 0402; Depth: 0.5mm; Ratings: AEC-Q200
C55 C56 = CMP-00652-2: 0402 330 pF 50 V ±5% Tolerance C0G SMT Multilayer Ceramic Capacitor; Insulation Resistance: 10GR; Voltage: 50V; Temperature Coefficient: 30ppm/°C; Install: POP; Material: Ceramic; Depth: 0.5mm; Termination: SMD/SMT; Dielectric: C0G; Packaging: Tape and Reel; Case/Package: 0402; Height: 0.5mm; Length: 1mm; Lead Free: Lead Free; RoHS Compliant: Yes; Thickness: 0.022inch; Case Code (Metric): 1005; Case Code (Imperial): 0402; Width: 0.5mm; Size: 0.5mm; Radiation Hardening: No; Pins: 2; Voltage Rating: 50V; Reach SVHC Compliant: No; Mounting Technology: Surface Mount; Tolerance: 5%; Min Operating Temperature: -55°C; Voltage Rating (DC): 50V; Construction: Flat; Package Quantity: 1; Max Operating Temperature: 125°C; Series: GRM
C57 C58 = CMP-00654-4: Multilayer Ceramic Capacitor, 22 uF, 25 V, ± 20%, X5R, 0805 [2012 Metric]; Install: POP; RoHS Compliant: Yes
C59 C61 = CMP-00369-1: Cap Ceramic 0.1uF 25V X5R 10% Pad SMD 0402 Multi Layer Ceramic Capacitor (MLCC); Install: POP; Packaging: Tape and Reel; Construction: Flat; Max Operating Temperature: 85°C; Case Code (Metric): 1005; Voltage Rating (DC): 25V; Min Operating Temperature: -55°C; Height: 0.5mm; Series: CL; Case/Package: 0402; Voltage: 25V; Package Quantity: 1; Radiation Hardening: No; Depth: 0.5mm; Thickness: 0.022inch; Lead Free: Lead Free; Tolerance: 10%; Length: 1mm; Mount: Surface Mount; Width: 0.02inch; Dielectric: X5R; RoHS Compliant: Yes; Voltage Rating: 25V; Case Code (Imperial): 0402
D2 = CMP-00259-3: Diode Schottky 20V 1A 2-Pin SOD-123FL T/R; Peak Non-Repetitive Surge Current: 40A; Element Configuration: Single; Max Reverse Current: 500uA; Install: POP; Radiation Hardening: No; Max Repetitive Reverse Voltage (Vrrm): 20V; Mount: Surface Mount; RoHS Compliant: Yes; Min Operating Temperature: -55°C; Max Operating Temperature: 125°C; Number of Pins: 2
D3 = CMP-00678-2: 22-V flat-clamp surge protection device 6-WSON -40 to 125; Clamping Voltage: 28V; Install: POP; Number of Channels: 1; RoHS Compliant: Yes; Series: -; Number of Circuits: 1; Max Operating Temperature: 125°C; Mounting Technology: Surface Mount; Min Operating Temperature: -40°C; Packaging: Cut Tape
D4 = CMP-00677-2: Quad 0.25-pF, ±3.6-V, ±12-kV ESD protection diode for USB 3.0, HDMI 2.0 & High Speed Signals; Power Line Protection: No; Number of Channels: 4; Diode Type: ZENER; Install: POP; Peak Pulse Power: 17W; Reverse Standoff Voltage: 3.6V; Interface: USB,HDMI; Peak Pulse Current: 5A; Min Breakdown Voltage: 5.5V; Pins: 10; Min Operating Temperature: -40°C; Max Operating Temperature: 125°C; Series: -; Packaging: Cut Tape; RoHS Compliant: Yes; Mounting Technology: Surface Mount; Reach SVHC Compliant: No; Number of Bidirectional Channels: 4; Operating Supply Voltage: 3.6V; Lead Free: Lead Free
J7 = CMP-00680-3: USB C Connector, 24 Contact(s), Female, Right Angle, Solder and Surface Mount Terminal, Locking, Receptacle; Mating Cycles: 10000; Number of Ports: 1; Voltage Rating: 20V; Number of Contacts: 24; Shielding: Shielded; Install: POP; Max Operating Temperature: 80°C; Min Operating Temperature: -30°C; Insulation Color: Black; Contact Plating: Gold; Termination: Solder; Connector Type: USB; RoHS Compliant: Yes; Series: DX07; Gender: Receptacle; Mounting Technology: Surface Mount,Through Hole,Horizontal; Packaging: Cut Tape
J8 = CMP-00144-9: 6 Pin Tag-Connect Header Footprint. Pads.; Install: DNP
R31 = CMP-00742-2: SMD Chip Resistor, 18 kOhm, ± 1%, 63 mW, 0402 [1005 Metric], Thick Film, General Purpose; Voltage Rating (AC): 50V; Temperature Coefficient: 100ppm/°C; Max Power Dissipation: 63mW; Install: POP; RoHS Compliant: Yes; Height: 0.016inch; Min Operating Temperature: -55°C; Series: RC; Case Code (Imperial): 0402; Termination: SMD/SMT; Length: 1mm; Features: Moisture Resistant; Reach SVHC Compliant: Unknown; Lead Free: Lead Free; Number of Terminations: 2; Depth: 0.5mm; Resistor Type: Thick Film; Resistance Tolerance: 1%; Max Operating Temperature: 155°C; Case Code (Metric): 1005; Military Standard: Not; Power Rating: 63mW; Package Quantity: 1; Tolerance: 1%; Voltage Rating: 50V; Construction: Rectangular; Technology: THICK FILM; Width: 0.02inch; Case/Package: 0402; Packaging: Tape and Reel
R35 R36 = CMP-00336-2: as R5 on sheet MCU; Features: Moisture Resistant; Length: 1mm; REACH SVHC: No SVHC; RoHS Compliant: Yes; Military Standard: Not; Size Code: 0402; Series: RC; Width: 0.5mm; Lead Free: Lead Free; Max Operating Temperature: 155°C; Height: 0.32mm; Voltage Rating (DC): 50V; Construction: Rectangular; Packaging: Tape and Reel; Tolerance: 1%; Case Code (Metric): 1005; Case Code (Imperial): 0402; Number of Pins: 2; Resistor Type: Thick Film; Number of Terminations: 2; Termination: SMD/SMT; Min Operating Temperature: -55°C; Case/Package: 0402; Height - Seated (Max): 0.016inch; Resistance Tolerance: 1%; Depth: 0.5mm
R37 = CMP-00309-1: Res Thick Film 0402 33K Ohm 1% 0.063W(1/16W) ±100ppm/C Pad SMD T/R; Voltage Rating (DC): 50V; Temperature Coefficient: 100ppm/°C; Power Rating: 63mW; Install: POP; Tolerance: 1%; Case/Package: 0402; RoHS Compliant: Yes; Lead Free: Lead Free; Package Quantity: 1; Weight: 2.3E-05oz; Termination: SMD/SMT; Depth: 0.5mm; Number of Pins: 2; Min Operating Temperature: -55°C; Construction: Rectangular; Number of Terminations: 2; Packaging: Tape and Reel; Case Code (Metric): 1005; Resistor Type: Thick Film; Height: 0.016inch; Series: RC; REACH SVHC: No SVHC; Features: Moisture Resistant; Size Code: 0402; Military Standard: Not; Width: 0.5mm; Voltage Rating: 50V; Case Code (Imperial): 0402; Max Power Dissipation: 63mW; Length: 1mm; Max Operating Temperature: 155°C; Resistance Tolerance: 1%
R38 = CMP-00351-1: as R3 on sheet MCU; Series: RC; Military Standard: Not; Case Code (Metric): 1005; Features: Moisture Resistant; Termination: SMD/SMT; Number of Terminations: 2; Temperature Coefficient: 100ppm/°C; Height: 0.016inch; Tolerance: 1%; Case/Package: 0402; Depth: 0.5mm; RoHS Compliant: Yes; Resistance Tolerance: 1%; Lead Free: Lead Free; Max Operating Temperature: 155°C; Min Operating Temperature: -55°C; Width: 0.02inch; Packaging: Tape and Reel; Technology: THICK FILM; Case Code (Imperial): 0402; Package Quantity: 1; REACH SVHC: No SVHC; Resistor Type: Thick Film; Max Power Dissipation: 63mW; Voltage Rating: 50V; Length: 0.039inch; Construction: Rectangular
R41-R46 R49 = CMP-00352-1: as R62 on sheet MCU; RoHS Compliant: Yes; Number of Terminations: 2; Case/Package: 0402; Case Code (Metric): 1005; Length: 0.039inch; Military Standard: Not; Size Code: 0402; Series: RC; Height: 0.016inch; Contact Plating: Tin; Features: Moisture Resistant; Width: 0.02inch; Mount: Surface Mount; Temperature Coefficient: 100ppm/°C; Package Quantity: 1; Resistor Type: Thick Film; Min Operating Temperature: -55°C; Max Operating Temperature: 155°C; Power Rating: 63mW; Tolerance: 1%; Depth: 0.5mm; Case Code (Imperial): 0402; Construction: Rectangular; Packaging: Tape and Reel; Radiation Hardening: No
R50 = CMP-00352-1: Res Thick Film 0402 10K Ohm 1% 1/16W ±100ppm/°C Molded SMD SMD T/R; Max Power Dissipation: 63mW; RoHS Compliant: Yes; Number of Terminations: 2; Case/Package: 0402; Case Code (Metric): 1005; Length: 0.039inch; Military Standard: Not; Size Code: 0402; Series: RC; Height: 0.016inch; Contact Plating: Tin; Features: Moisture Resistant; Width: 0.02inch; Mount: Surface Mount; Temperature Coefficient: 100ppm/°C; Package Quantity: 1; Resistor Type: Thick Film; Min Operating Temperature: -55°C; Max Operating Temperature: 155°C; Power Rating: 63mW; Tolerance: 1%; Depth: 0.5mm; Case Code (Imperial): 0402; Construction: Rectangular; Packaging: Tape and Reel; Radiation Hardening: No
TP24 TP25 TP27 = CMP-00021-4: Test Point Circle 30; Install: DNP
U2 = CMP-058-000001-1: Fixed 5V LDO Voltage Regulators LDO CMOS LowCurr SOT23 TR 3K; Install: POP; Output Voltage: 5V
U8 = CMP-00215-5: IC LOAD SWITCH W/DIS 1.5A 4WLCSP; On-State Resistance: 400mR; Turn-On Delay Time: 195us; Install: POP; Power Dissipation: 400mW; Number of Outputs: 1; Output Configuration: High Side; Operating Supply Voltage: 5.5V; Interface: On/Off; Packaging: Tape and Reel; Max Supply Current: 1.5A; Number of Pins: 4; Package Quantity: 3000; Max Operating Temperature: 85°C; RoHS Compliant: Yes; Min Operating Temperature: -40°C; Lead Free: Lead Free; Output Current: 1.5A; Max Power Dissipation: 400mW; Mount: Surface Mount; Series: -; Max Output Current: 1.5A; Halogen Free: Halogen Free
U10 = CMP-00653-4: Highly integrated USB Type-C® and USB PD controller with pre-configured GUI 38-WQFN -40 to 125; Install: POP
U12 = CMP-00660-3: IC EEPROM 256KBIT 400KHZ 8SOIC; Supply Current: 3mA; Operating Supply Voltage: 5V; Density: 256Kb; Write Protection: YES; Access Time: 500ns; Nominal Supply Voltage: 5.5V; Organization: 32KX8; Memory Format: Non-Volatile,EEPROM; Interface: I2C,Serial; Memory Size: 32000; Min Supply Voltage: 1.8V; Write Cycle Time-Max (tWC): 5ms; Access Time-Max: 900ns; Frequency: 1MHz; Install: POP; Lead Free: Lead Free; Reach SVHC Compliant: No; Packaging: Tape and Reel; Mounting Technology: Surface Mount; Case/Package: SOIC; Max Operating Temperature: 85°C; Height: 1.5mm; Pins: 8; Length: 5mm; Max Supply Voltage: 5.5V; Halogen Free: Halogen Free; RoHS Compliant: Yes; Series: -; Radiation Hardening: No; Width: 4mm; Clock Frequency: 400kHz; Min Operating Temperature: -40°C